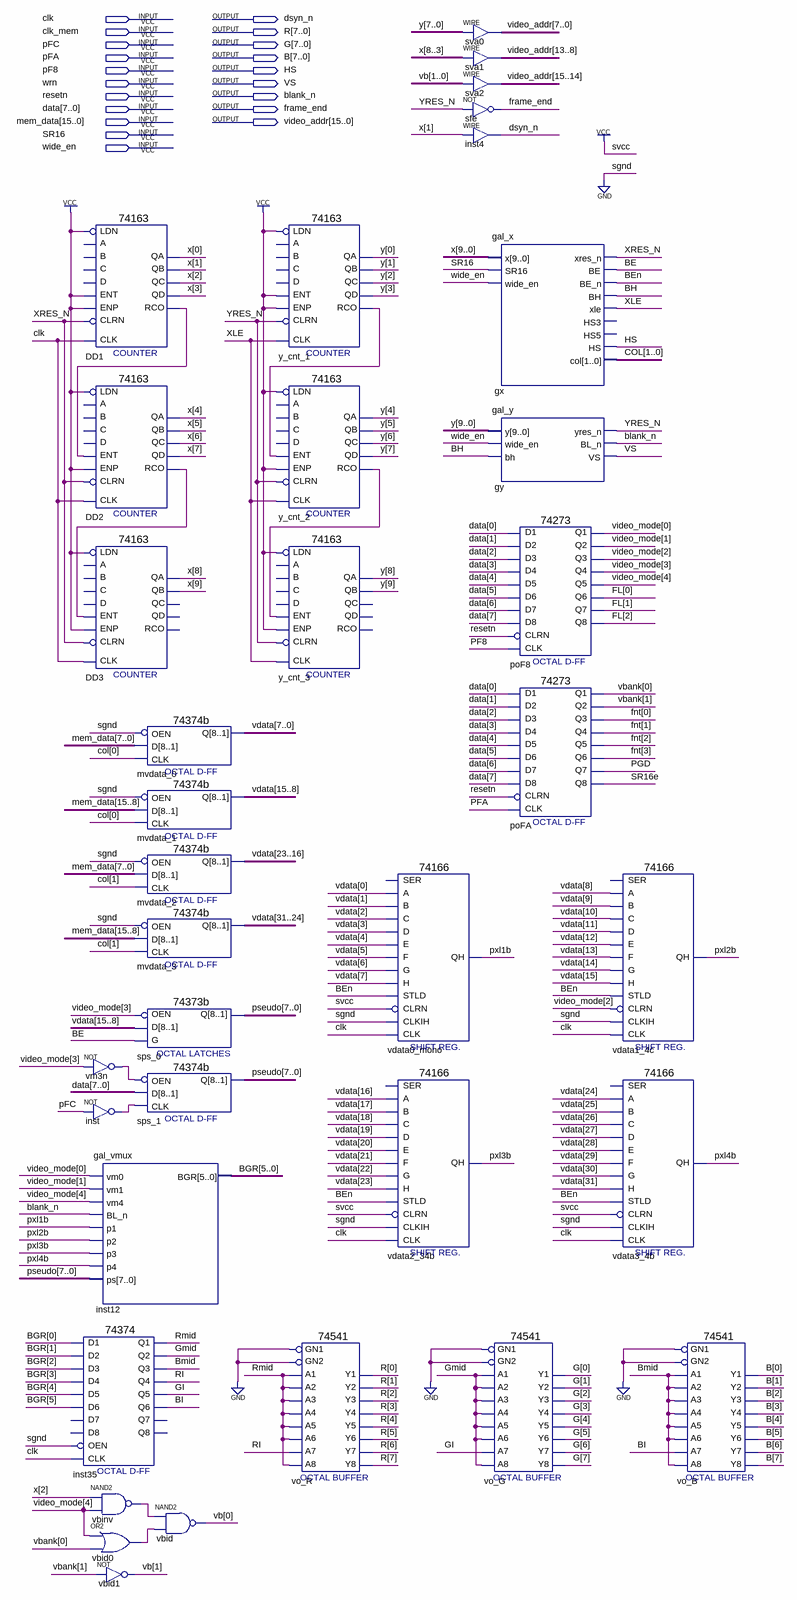
[diagram p0: schematic sheet]
// Quartus schematic orion_video_sch.bdf as structural Verilog: 36 symbols, 20 pins
module orion_video_sch (
  input  clk,
  input  clk_mem,
  input  pFC,
  input  pFA,
  input  pF8,
  input  wrn,
  input  resetn,
  input  [7:0] data,
  input  [15:0] mem_data,
  input  SR16,
  input  wide_en,
  output dsyn_n,
  output [7:0] R,
  output [7:0] G,
  output [7:0] B,
  output HS,
  output VS,
  output blank_n,
  output frame_end,
  output [15:0] video_addr
);

  wire BE, BEn, BH, BI, Bmid, DD1_rco, DD2_rco, GI, Gmid, inst_out, PGD, pxl1b, pxl2b, pxl3b, pxl4b, RI,
       Rmid, SR16e, vbid0_out, vbinv_out, vm3n_out, XLE, XRES_N, y_cnt_1_rco, y_cnt_2_rco, YRES_N;
  wire [1:0] COL, vb, vbank;
  wire [2:0] FL;
  wire [3:0] fnt;
  wire [4:0] video_mode;
  wire [5:0] BGR;
  wire [7:0] pseudo;
  wire [9:0] x, y;
  wire [31:0] vdata;

  \74163  DD1 (
    .ENT(1'b1), .CLRN(XRES_N), .CLK(clk), .ENP(1'b1), .LDN(1'b1), .QA(x[0]), .QB(x[1]), .QC(x[2]), .QD(x[3]),
    .RCO(DD1_rco));  // open: C, B, A, D
  \74163  DD2 (
    .ENT(DD1_rco), .CLRN(XRES_N), .CLK(clk), .ENP(1'b1), .LDN(1'b1), .QA(x[4]), .QB(x[5]), .QC(x[6]),
    .QD(x[7]), .RCO(DD2_rco));  // open: C, B, A, D
  \74163  DD3 (
    .ENT(DD2_rco), .CLRN(XRES_N), .CLK(clk), .ENP(1'b1), .LDN(1'b1), .QA(x[8]), .QB(x[9]));  // open: C, B, A, D, QC, QD, RCO
  not vm3n (vm3n_out, video_mode[3]);
  not inst (inst_out, pFC);
  gal_vmux inst12 (
    .vm0(video_mode[0]), .vm1(video_mode[1]), .vm4(video_mode[4]), .BL_n(blank_n), .p1(pxl1b), .p2(pxl2b),
    .p3(pxl3b), .p4(pxl4b), .ps(pseudo), .BGR(BGR));
  \74374  inst35 (
    .D1(BGR[0]), .D2(BGR[1]), .D3(BGR[2]), .D4(BGR[3]), .D6(BGR[5]), .D5(BGR[4]), .OEN(1'b0), .CLK(clk),
    .Q2(Gmid), .Q3(Bmid), .Q5(GI), .Q4(RI), .Q6(BI), .Q1(Rmid));  // open: D8, D7, Q7, Q8
  nand vbinv (vbinv_out, x[2], video_mode[4]);
  or vbid0 (vbid0_out, video_mode[4], vbank[0]);
  not vbid1 (vb[1], vbank[1]);
  \74374b  mvdata_0 (.D(mem_data[7:0]), .OEN(1'b0), .CLK(COL[0]), .Q(vdata[7:0]));
  \74374b  mvdata_1 (.D(mem_data[15:8]), .OEN(1'b0), .CLK(COL[0]), .Q(vdata[15:8]));
  \74374b  mvdata_2 (.D(mem_data[7:0]), .OEN(1'b0), .CLK(COL[1]), .Q(vdata[23:16]));
  \74374b  mvdata_3 (.D(mem_data[15:8]), .OEN(1'b0), .CLK(COL[1]), .Q(vdata[31:24]));
  \74373b  sps_0 (.D(vdata[15:8]), .G(BE), .OEN(video_mode[3]), .Q(pseudo));
  \74374b  sps_1 (.D(data), .OEN(vm3n_out), .CLK(inst_out), .Q(pseudo));
  nand vbid (vb[0], vbinv_out, vbid0_out);
  \74163  y_cnt_1 (
    .ENT(1'b1), .CLRN(YRES_N), .CLK(XLE), .ENP(1'b1), .LDN(1'b1), .QA(y[0]), .QB(y[1]), .QC(y[2]), .QD(y[3]),
    .RCO(y_cnt_1_rco));  // open: C, B, A, D
  \74163  y_cnt_2 (
    .ENT(y_cnt_1_rco), .CLRN(YRES_N), .CLK(XLE), .ENP(1'b1), .LDN(1'b1), .QA(y[4]), .QB(y[5]), .QC(y[6]),
    .QD(y[7]), .RCO(y_cnt_2_rco));  // open: C, B, A, D
  \74163  y_cnt_3 (
    .ENT(y_cnt_2_rco), .CLRN(YRES_N), .CLK(XLE), .ENP(1'b1), .LDN(1'b1), .QA(y[8]), .QB(y[9]));  // open: C, B, A, D, QC, QD, RCO
  \74541  vo_R (
    .GN2(1'b0), .A1(Rmid), .A4(Rmid), .A3(Rmid), .A2(Rmid), .A7(RI), .A6(Rmid), .A5(Rmid), .GN1(1'b0),
    .A8(Rmid), .Y8(R[7]), .Y5(R[4]), .Y6(R[5]), .Y7(R[6]), .Y2(R[1]), .Y3(R[2]), .Y4(R[3]), .Y1(R[0]));
  \74166  vdata0_mono (
    .A(vdata[0]), .C(vdata[2]), .D(vdata[3]), .E(vdata[4]), .B(vdata[1]), .STLD(BEn), .H(vdata[7]),
    .G(vdata[6]), .F(vdata[5]), .CLK(clk), .CLRN(1'b1), .CLKIH(1'b0), .QH(pxl1b));  // open: SER
  \74166  vdata2_34b (
    .A(vdata[16]), .C(vdata[18]), .D(vdata[19]), .E(vdata[20]), .B(vdata[17]), .STLD(BEn), .H(vdata[23]),
    .G(vdata[22]), .F(vdata[21]), .CLK(clk), .CLRN(1'b1), .CLKIH(1'b0), .QH(pxl3b));  // open: SER
  assign video_addr[7:0] = y[7:0];  // WIRE sva0
  assign video_addr[13:8] = x[8:3];  // WIRE sva1
  assign video_addr[15:14] = vb;  // WIRE sva2
  not sfe (frame_end, YRES_N);
  assign dsyn_n = x[1];  // WIRE inst4
  gal_x gx (
    .x(x), .SR16(SR16), .wide_en(wide_en), .xres_n(XRES_N), .BE(BE), .BE_n(BEn), .BH(BH), .xle(XLE), .HS(HS),
    .col(COL));  // open: HS3, HS5
  gal_y gy (.y(y), .wide_en(wide_en), .bh(BH), .yres_n(YRES_N), .BL_n(blank_n), .VS(VS));
  \74273  poF8 (
    .D2(data[1]), .D3(data[2]), .D1(data[0]), .D4(data[3]), .D7(data[6]), .D6(data[5]), .D5(data[4]),
    .D8(data[7]), .CLK(pF8), .CLRN(resetn), .Q4(video_mode[3]), .Q1(video_mode[0]), .Q2(video_mode[1]),
    .Q3(video_mode[2]), .Q6(FL[0]), .Q5(video_mode[4]), .Q7(FL[1]), .Q8(FL[2]));
  \74273  poFA (
    .D2(data[1]), .D3(data[2]), .D1(data[0]), .D4(data[3]), .D7(data[6]), .D6(data[5]), .D5(data[4]),
    .D8(data[7]), .CLK(pFA), .CLRN(resetn), .Q4(fnt[1]), .Q1(vbank[0]), .Q2(vbank[1]), .Q3(fnt[0]),
    .Q6(fnt[3]), .Q5(fnt[2]), .Q7(PGD), .Q8(SR16e));
  \74541  vo_G (
    .GN2(1'b0), .A1(Gmid), .A4(Gmid), .A3(Gmid), .A2(Gmid), .A7(GI), .A6(Gmid), .A5(Gmid), .GN1(1'b0),
    .A8(Gmid), .Y8(G[7]), .Y5(G[4]), .Y6(G[5]), .Y7(G[6]), .Y2(G[1]), .Y3(G[2]), .Y4(G[3]), .Y1(G[0]));
  \74166  vdata1_4c (
    .A(vdata[8]), .C(vdata[10]), .D(vdata[11]), .E(vdata[12]), .B(vdata[9]), .STLD(BEn), .H(vdata[15]),
    .G(vdata[14]), .F(vdata[13]), .CLK(clk), .CLRN(video_mode[2]), .CLKIH(1'b0), .QH(pxl2b));  // open: SER
  \74166  vdata3_4b (
    .A(vdata[24]), .C(vdata[26]), .D(vdata[27]), .E(vdata[28]), .B(vdata[25]), .STLD(BEn), .H(vdata[31]),
    .G(vdata[30]), .F(vdata[29]), .CLK(clk), .CLRN(1'b1), .CLKIH(1'b0), .QH(pxl4b));  // open: SER
  \74541  vo_B (
    .GN2(1'b0), .A1(Bmid), .A4(Bmid), .A3(Bmid), .A2(Bmid), .A7(BI), .A6(Bmid), .A5(Bmid), .GN1(1'b0),
    .A8(Bmid), .Y8(B[7]), .Y5(B[4]), .Y6(B[5]), .Y7(B[6]), .Y2(B[1]), .Y3(B[2]), .Y4(B[3]), .Y1(B[0]));
endmodule
